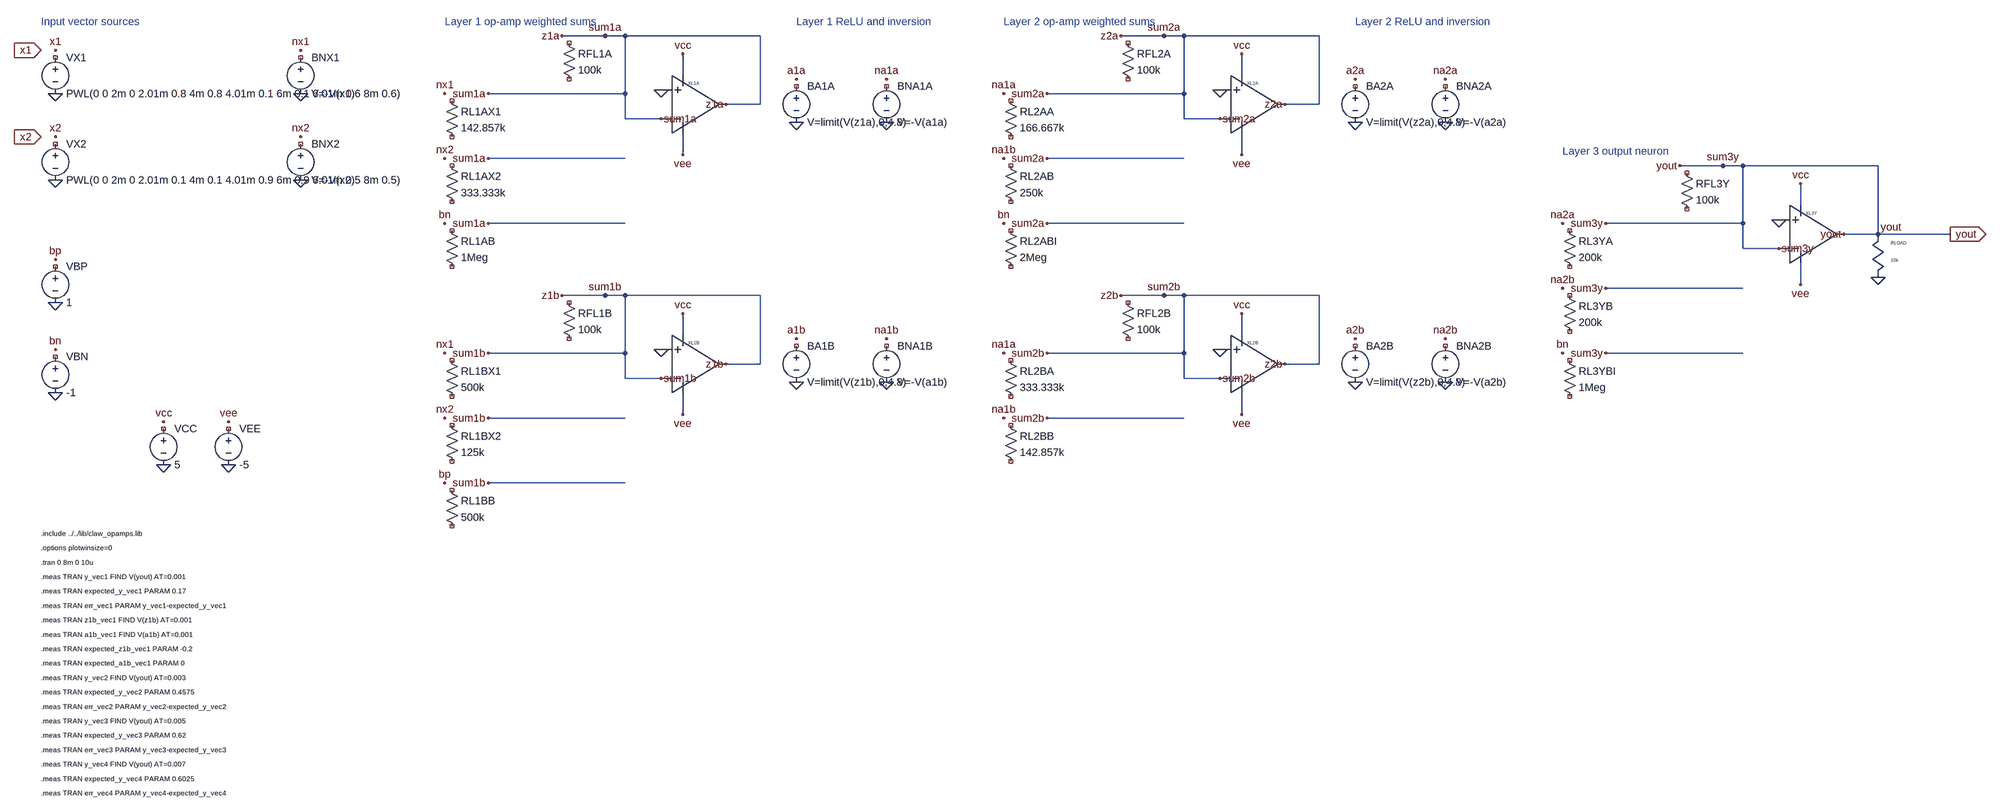
[diagram p0: schematic opamp_mlp_forward_pass.asc]
opamp_mlp_forward_pass.asc, the LTspice schematic file:
Version 4
SHEET 1 4528 1925
WIRE 1488 152 1488 104
WIRE 1488 280 1488 328
WIRE 1316 64 1360 64
WIRE 1360 64 1360 248
WIRE 1360 248 1440 248
WIRE 1584 216 1660 216
WIRE 1660 216 1660 64
WIRE 1660 64 1220 64
WIRE 1056 192 1360 192
WIRE 1056 336 1360 336
WIRE 1056 480 1360 480
WIRE 1488 728 1488 680
WIRE 1488 856 1488 904
WIRE 1316 640 1360 640
WIRE 1360 640 1360 824
WIRE 1360 824 1440 824
WIRE 1584 792 1660 792
WIRE 1660 792 1660 640
WIRE 1660 640 1220 640
WIRE 1056 768 1360 768
WIRE 1056 912 1360 912
WIRE 1056 1056 1360 1056
WIRE 2728 152 2728 104
WIRE 2728 280 2728 328
WIRE 2556 64 2600 64
WIRE 2600 64 2600 248
WIRE 2600 248 2680 248
WIRE 2824 216 2900 216
WIRE 2900 216 2900 64
WIRE 2900 64 2460 64
WIRE 2296 192 2600 192
WIRE 2296 336 2600 336
WIRE 2296 480 2600 480
WIRE 2728 728 2728 680
WIRE 2728 856 2728 904
WIRE 2556 640 2600 640
WIRE 2600 640 2600 824
WIRE 2600 824 2680 824
WIRE 2824 792 2900 792
WIRE 2900 792 2900 640
WIRE 2900 640 2460 640
WIRE 2296 768 2600 768
WIRE 2296 912 2600 912
WIRE 3968 440 3968 392
WIRE 3968 568 3968 616
WIRE 3796 352 3840 352
WIRE 3840 352 3840 536
WIRE 3840 536 3920 536
WIRE 4064 504 4140 504
WIRE 4140 504 4140 352
WIRE 4140 352 3700 352
WIRE 3536 480 3840 480
WIRE 3536 624 3840 624
WIRE 3536 768 3840 768
WIRE 4140 504 4300 504
SYMBOL voltage 96 96 R0
SYMATTR InstName VX1
SYMATTR Value PWL(0 0 2m 0 2.01m 0.8 4m 0.8 4.01m 0.1 6m 0.1 6.01m 0.6 8m 0.6)
SYMBOL voltage 96 288 R0
SYMATTR InstName VX2
SYMATTR Value PWL(0 0 2m 0 2.01m 0.1 4m 0.1 4.01m 0.9 6m 0.9 6.01m 0.5 8m 0.5)
SYMBOL voltage 96 560 R0
SYMATTR InstName VBP
SYMATTR Value 1
SYMBOL voltage 96 760 R0
SYMATTR InstName VBN
SYMATTR Value -1
SYMBOL voltage 336 920 R0
SYMATTR InstName VCC
SYMATTR Value 5
SYMBOL voltage 480 920 R0
SYMATTR InstName VEE
SYMATTR Value -5
SYMBOL voltage 640 96 R0
SYMATTR InstName BNX1
SYMATTR Value V=-V(x1)
SYMBOL voltage 640 288 R0
SYMATTR InstName BNX2
SYMATTR Value V=-V(x2)
SYMBOL opamp2 1440 152 R0
SYMATTR InstName XL1A
SYMATTR Value CLAW_IDEAL_OPAMP
SYMBOL res 1220 64 R0
SYMATTR InstName RFL1A
SYMATTR Value 100k
SYMBOL res 960 192 R0
SYMATTR InstName RL1AX1
SYMATTR Value 142.857k
SYMBOL res 960 336 R0
SYMATTR InstName RL1AX2
SYMATTR Value 333.333k
SYMBOL res 960 480 R0
SYMATTR InstName RL1AB
SYMATTR Value 1Meg
SYMBOL opamp2 1440 728 R0
SYMATTR InstName XL1B
SYMATTR Value CLAW_IDEAL_OPAMP
SYMBOL res 1220 640 R0
SYMATTR InstName RFL1B
SYMATTR Value 100k
SYMBOL res 960 768 R0
SYMATTR InstName RL1BX1
SYMATTR Value 500k
SYMBOL res 960 912 R0
SYMATTR InstName RL1BX2
SYMATTR Value 125k
SYMBOL res 960 1056 R0
SYMATTR InstName RL1BB
SYMATTR Value 500k
SYMBOL voltage 1740 160 R0
SYMATTR InstName BA1A
SYMATTR Value V=limit(V(z1a),0,4.8)
SYMBOL voltage 1740 736 R0
SYMATTR InstName BA1B
SYMATTR Value V=limit(V(z1b),0,4.8)
SYMBOL voltage 1940 160 R0
SYMATTR InstName BNA1A
SYMATTR Value V=-V(a1a)
SYMBOL voltage 1940 736 R0
SYMATTR InstName BNA1B
SYMATTR Value V=-V(a1b)
SYMBOL opamp2 2680 152 R0
SYMATTR InstName XL2A
SYMATTR Value CLAW_IDEAL_OPAMP
SYMBOL res 2460 64 R0
SYMATTR InstName RFL2A
SYMATTR Value 100k
SYMBOL res 2200 192 R0
SYMATTR InstName RL2AA
SYMATTR Value 166.667k
SYMBOL res 2200 336 R0
SYMATTR InstName RL2AB
SYMATTR Value 250k
SYMBOL res 2200 480 R0
SYMATTR InstName RL2ABI
SYMATTR Value 2Meg
SYMBOL opamp2 2680 728 R0
SYMATTR InstName XL2B
SYMATTR Value CLAW_IDEAL_OPAMP
SYMBOL res 2460 640 R0
SYMATTR InstName RFL2B
SYMATTR Value 100k
SYMBOL res 2200 768 R0
SYMATTR InstName RL2BA
SYMATTR Value 333.333k
SYMBOL res 2200 912 R0
SYMATTR InstName RL2BB
SYMATTR Value 142.857k
SYMBOL voltage 2980 160 R0
SYMATTR InstName BA2A
SYMATTR Value V=limit(V(z2a),0,4.8)
SYMBOL voltage 2980 736 R0
SYMATTR InstName BA2B
SYMATTR Value V=limit(V(z2b),0,4.8)
SYMBOL voltage 3180 160 R0
SYMATTR InstName BNA2A
SYMATTR Value V=-V(a2a)
SYMBOL voltage 3180 736 R0
SYMATTR InstName BNA2B
SYMATTR Value V=-V(a2b)
SYMBOL opamp2 3920 440 R0
SYMATTR InstName XL3Y
SYMATTR Value CLAW_IDEAL_OPAMP
SYMBOL res 3700 352 R0
SYMATTR InstName RFL3Y
SYMATTR Value 100k
SYMBOL res 3440 480 R0
SYMATTR InstName RL3YA
SYMATTR Value 200k
SYMBOL res 3440 624 R0
SYMATTR InstName RL3YB
SYMATTR Value 200k
SYMBOL res 3440 768 R0
SYMATTR InstName RL3YBI
SYMATTR Value 1Meg
SYMBOL res_v 4140 504 R0
SYMATTR InstName RLOAD
SYMATTR Value 10k
FLAG 96 96 x1
FLAG 96 192 0
FLAG 96 288 x2
FLAG 96 384 0
FLAG 96 560 bp
FLAG 96 656 0
FLAG 96 760 bn
FLAG 96 856 0
FLAG 336 920 vcc
FLAG 336 1016 0
FLAG 480 920 vee
FLAG 480 1016 0
FLAG 640 96 nx1
FLAG 640 192 0
FLAG 640 288 nx2
FLAG 640 384 0
FLAG 1440 184 0
FLAG 1440 248 sum1a
FLAG 1584 216 z1a
FLAG 1488 104 vcc
FLAG 1488 328 vee
FLAG 1220 64 z1a
FLAG 1316 64 sum1a
FLAG 960 192 nx1
FLAG 1056 192 sum1a
FLAG 960 336 nx2
FLAG 1056 336 sum1a
FLAG 960 480 bn
FLAG 1056 480 sum1a
FLAG 1440 760 0
FLAG 1440 824 sum1b
FLAG 1584 792 z1b
FLAG 1488 680 vcc
FLAG 1488 904 vee
FLAG 1220 640 z1b
FLAG 1316 640 sum1b
FLAG 960 768 nx1
FLAG 1056 768 sum1b
FLAG 960 912 nx2
FLAG 1056 912 sum1b
FLAG 960 1056 bp
FLAG 1056 1056 sum1b
FLAG 1740 160 a1a
FLAG 1740 256 0
FLAG 1740 736 a1b
FLAG 1740 832 0
FLAG 1940 160 na1a
FLAG 1940 256 0
FLAG 1940 736 na1b
FLAG 1940 832 0
FLAG 2680 184 0
FLAG 2680 248 sum2a
FLAG 2824 216 z2a
FLAG 2728 104 vcc
FLAG 2728 328 vee
FLAG 2460 64 z2a
FLAG 2556 64 sum2a
FLAG 2200 192 na1a
FLAG 2296 192 sum2a
FLAG 2200 336 na1b
FLAG 2296 336 sum2a
FLAG 2200 480 bn
FLAG 2296 480 sum2a
FLAG 2680 760 0
FLAG 2680 824 sum2b
FLAG 2824 792 z2b
FLAG 2728 680 vcc
FLAG 2728 904 vee
FLAG 2460 640 z2b
FLAG 2556 640 sum2b
FLAG 2200 768 na1a
FLAG 2296 768 sum2b
FLAG 2200 912 na1b
FLAG 2296 912 sum2b
FLAG 2980 160 a2a
FLAG 2980 256 0
FLAG 2980 736 a2b
FLAG 2980 832 0
FLAG 3180 160 na2a
FLAG 3180 256 0
FLAG 3180 736 na2b
FLAG 3180 832 0
FLAG 3920 472 0
FLAG 3920 536 sum3y
FLAG 4064 504 yout
FLAG 3968 392 vcc
FLAG 3968 616 vee
FLAG 3700 352 yout
FLAG 3796 352 sum3y
FLAG 3440 480 na2a
FLAG 3536 480 sum3y
FLAG 3440 624 na2b
FLAG 3536 624 sum3y
FLAG 3440 768 bn
FLAG 3536 768 sum3y
FLAG 4140 504 yout
FLAG 4140 600 0
FLAG 64 96 x1
IOPIN 64 96 In
FLAG 64 288 x2
IOPIN 64 288 In
FLAG 4300 504 yout
IOPIN 4300 504 Out
TEXT 64 32 Left 2 Input vector sources
TEXT 960 32 Left 2 Layer 1 op-amp weighted sums
TEXT 1740 32 Left 2 Layer 1 ReLU and inversion
TEXT 2200 32 Left 2 Layer 2 op-amp weighted sums
TEXT 2980 32 Left 2 Layer 2 ReLU and inversion
TEXT 3440 320 Left 2 Layer 3 output neuron
TEXT 64 1168 Left 1 !.include ../../lib/claw_opamps.lib
TEXT 64 1200 Left 1 !.options plotwinsize=0
TEXT 64 1232 Left 1 !.tran 0 8m 0 10u
TEXT 64 1264 Left 1 !.meas TRAN y_vec1 FIND V(yout) AT=0.001
TEXT 64 1296 Left 1 !.meas TRAN expected_y_vec1 PARAM 0.17
TEXT 64 1328 Left 1 !.meas TRAN err_vec1 PARAM y_vec1-expected_y_vec1
TEXT 64 1360 Left 1 !.meas TRAN z1b_vec1 FIND V(z1b) AT=0.001
TEXT 64 1392 Left 1 !.meas TRAN a1b_vec1 FIND V(a1b) AT=0.001
TEXT 64 1424 Left 1 !.meas TRAN expected_z1b_vec1 PARAM -0.2
TEXT 64 1456 Left 1 !.meas TRAN expected_a1b_vec1 PARAM 0
TEXT 64 1488 Left 1 !.meas TRAN y_vec2 FIND V(yout) AT=0.003
TEXT 64 1520 Left 1 !.meas TRAN expected_y_vec2 PARAM 0.4575
TEXT 64 1552 Left 1 !.meas TRAN err_vec2 PARAM y_vec2-expected_y_vec2
TEXT 64 1584 Left 1 !.meas TRAN y_vec3 FIND V(yout) AT=0.005
TEXT 64 1616 Left 1 !.meas TRAN expected_y_vec3 PARAM 0.62
TEXT 64 1648 Left 1 !.meas TRAN err_vec3 PARAM y_vec3-expected_y_vec3
TEXT 64 1680 Left 1 !.meas TRAN y_vec4 FIND V(yout) AT=0.007
TEXT 64 1712 Left 1 !.meas TRAN expected_y_vec4 PARAM 0.6025
TEXT 64 1744 Left 1 !.meas TRAN err_vec4 PARAM y_vec4-expected_y_vec4

The netlist it stands for:
* opamp_mlp_forward_pass.asc
VX1 NC_01 0 PWL(0 0 2m 0 2.01m 0.8 4m 0.8 4.01m 0.1 6m 0.1 6.01m 0.6 8m 0.6)
VX2 NC_02 0 PWL(0 0 2m 0 2.01m 0.1 4m 0.1 4.01m 0.9 6m 0.9 6.01m 0.5 8m 0.5)
VBP NC_03 0 1
VBN NC_04 0 -1
VCC NC_05 0 5
VEE NC_06 0 -5
V§BNX1 NC_07 0 V=-V(x1)
V§BNX2 NC_08 0 V=-V(x2)
XXL1A CLAW_IDEAL_OPAMP CLAW_IDEAL_OPAMP
RFL1A NC_09 NC_10 100k
RL1AX1 NC_11 NC_12 142.857k
RL1AX2 NC_13 NC_14 333.333k
RL1AB NC_15 NC_16 1Meg
XXL1B CLAW_IDEAL_OPAMP CLAW_IDEAL_OPAMP
RFL1B NC_17 NC_18 100k
RL1BX1 NC_19 NC_20 500k
RL1BX2 NC_21 NC_22 125k
RL1BB NC_23 NC_24 500k
V§BA1A NC_25 0 V=limit(V(z1a),0,4.8)
V§BA1B NC_26 0 V=limit(V(z1b),0,4.8)
V§BNA1A NC_27 0 V=-V(a1a)
V§BNA1B NC_28 0 V=-V(a1b)
XXL2A CLAW_IDEAL_OPAMP CLAW_IDEAL_OPAMP
RFL2A NC_29 NC_30 100k
RL2AA NC_31 NC_32 166.667k
RL2AB NC_33 NC_34 250k
RL2ABI NC_35 NC_36 2Meg
XXL2B CLAW_IDEAL_OPAMP CLAW_IDEAL_OPAMP
RFL2B NC_37 NC_38 100k
RL2BA NC_39 NC_40 333.333k
RL2BB NC_41 NC_42 142.857k
V§BA2A NC_43 0 V=limit(V(z2a),0,4.8)
V§BA2B NC_44 0 V=limit(V(z2b),0,4.8)
V§BNA2A NC_45 0 V=-V(a2a)
V§BNA2B NC_46 0 V=-V(a2b)
XXL3Y CLAW_IDEAL_OPAMP CLAW_IDEAL_OPAMP
RFL3Y NC_47 NC_48 100k
RL3YA NC_49 NC_50 200k
RL3YB NC_51 NC_52 200k
RL3YBI NC_53 NC_54 1Meg
RLOAD yout 0 10k
* Input vector sources
* Layer 1 op-amp weighted sums
* Layer 1 ReLU and inversion
* Layer 2 op-amp weighted sums
* Layer 2 ReLU and inversion
* Layer 3 output neuron
.include ../../lib/claw_opamps.lib
.options plotwinsize=0
.tran 0 8m 0 10u
.meas TRAN y_vec1 FIND V(yout) AT=0.001
.meas TRAN expected_y_vec1 PARAM 0.17
.meas TRAN err_vec1 PARAM y_vec1-expected_y_vec1
.meas TRAN z1b_vec1 FIND V(z1b) AT=0.001
.meas TRAN a1b_vec1 FIND V(a1b) AT=0.001
.meas TRAN expected_z1b_vec1 PARAM -0.2
.meas TRAN expected_a1b_vec1 PARAM 0
.meas TRAN y_vec2 FIND V(yout) AT=0.003
.meas TRAN expected_y_vec2 PARAM 0.4575
.meas TRAN err_vec2 PARAM y_vec2-expected_y_vec2
.meas TRAN y_vec3 FIND V(yout) AT=0.005
.meas TRAN expected_y_vec3 PARAM 0.62
.meas TRAN err_vec3 PARAM y_vec3-expected_y_vec3
.meas TRAN y_vec4 FIND V(yout) AT=0.007
.meas TRAN expected_y_vec4 PARAM 0.6025
.meas TRAN err_vec4 PARAM y_vec4-expected_y_vec4
.backanno
.end